# EAGLE design door system (EAGLE 9.7.0)
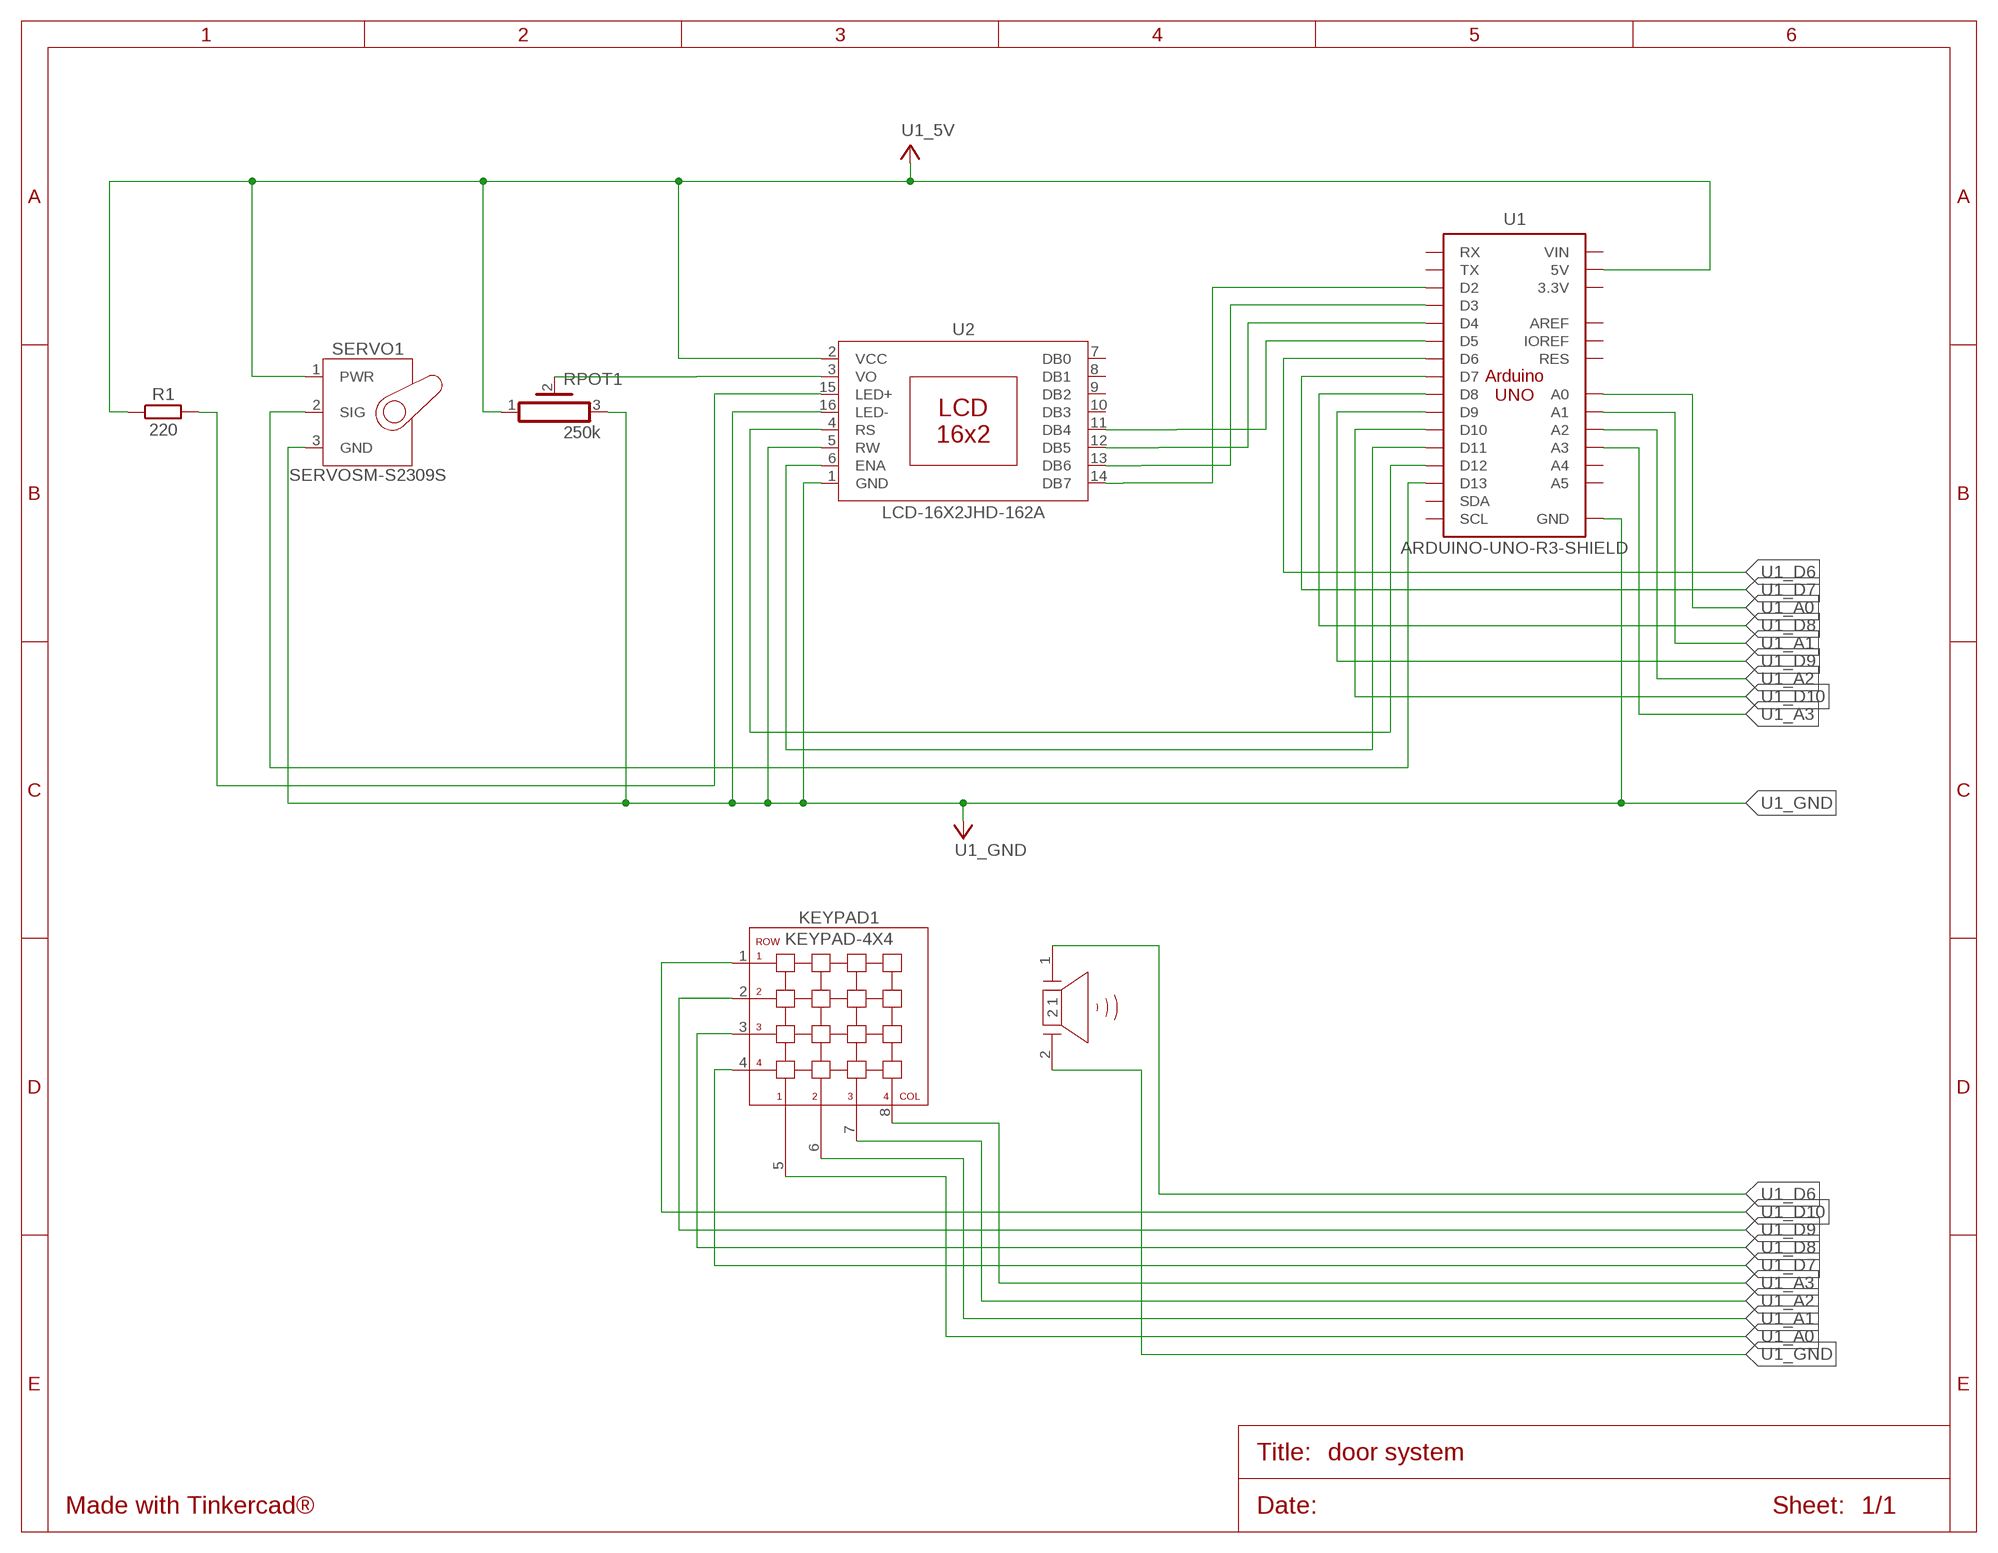
[diagram p0: schematic, sheet 1]

## Parts
KEYPAD1  KEYPAD-4X4  [1X08]
PIEZO1  PIEZO  [PIEZO]
R1  220  RESISTOR_AXIAL-10.16MM-PITCH  [RESAD1016W63L850D250B]
RPOT1  250k  POT_HA-06  [HA-06-SM065]
SERVO1  SERVOSM-S2309S  [SM-S2309S]
U1  ARDUINO-UNO-R3-SHIELD  [ARDUINO-UNO-R3-SHIELD]
U2  LCD-16X2JHD-162A  [JHD-162A]

## Nets
U1_5V: R1.1 RPOT1.1 SERVO1.1(PWR) U1.5V U2.2(VCC)
U1_A0: KEYPAD1.5(COL1) U1.A0
U1_A1: KEYPAD1.6(COL2) U1.A1
U1_A2: KEYPAD1.7(COL3) U1.A2
U1_A3: KEYPAD1.8(COL4) U1.A3
U1_D2: U1.D2 U2.14(DB7)
U1_D3: U1.D3 U2.13(DB6)
U1_D4: U1.D4 U2.12(DB5)
U1_D5: U1.D5 U2.11(DB4)
U1_D6: PIEZO1.1 U1.D6
U1_D7: KEYPAD1.4(ROW4) U1.D7
U1_D8: KEYPAD1.3(ROW3) U1.D8
U1_D9: KEYPAD1.2(ROW2) U1.D9
U1_D10: KEYPAD1.1(ROW1) U1.D10
U1_D11: U1.D11 U2.6(ENA)
U1_D12: U1.D12 U2.4(RS)
U1_D13: SERVO1.2(SIG) U1.D13
U1_GND: PIEZO1.2 RPOT1.3 SERVO1.3(GND) U1.GND@0(GND) U1.GND@1(GND) U1.GND@2(GND) U2.1(GND) U2.5(RW) U2.16(LED-)
U2_LED+: R1.2 U2.15(LED+)
U2_VO: RPOT1.2 U2.3(VO)
Unconnected: U1.3.3V U1.A4 U1.A5 U1.AREF U1.IOREF U1.RES U1.RX U1.SCL U1.SDA U1.TX U1.VIN U2.7(DB0) U2.8(DB1) U2.9(DB2) U2.10(DB3)

## Library data of the parts
KEYPAD1 = Tinkercad:KEYPAD-4X4
PIEZO1 = Tinkercad:PIEZO: Piezoelectric Sounders / Buzzers Reference Datasheet <https://www.murata.com/products/productdata/8801054621726/SPEC-PKM17EPPH4001-B0.pdf?1517839212000>
R1 = Tinkercad:RESISTOR: Resistor Fixed - Generic
RPOT1 = Tinkercad:POT: Rectangular Trimmer Potentiometers - PV36 Series Datasheet <https://www.bourns.com/docs/Product-Datasheets/pv36.pdf>
SERVO1 = Tinkercad:SERVO
U1 = Tinkercad:ARDUINO-UNO-R3-SHIELD
U2 = Tinkercad:LCD-16X2

## Board
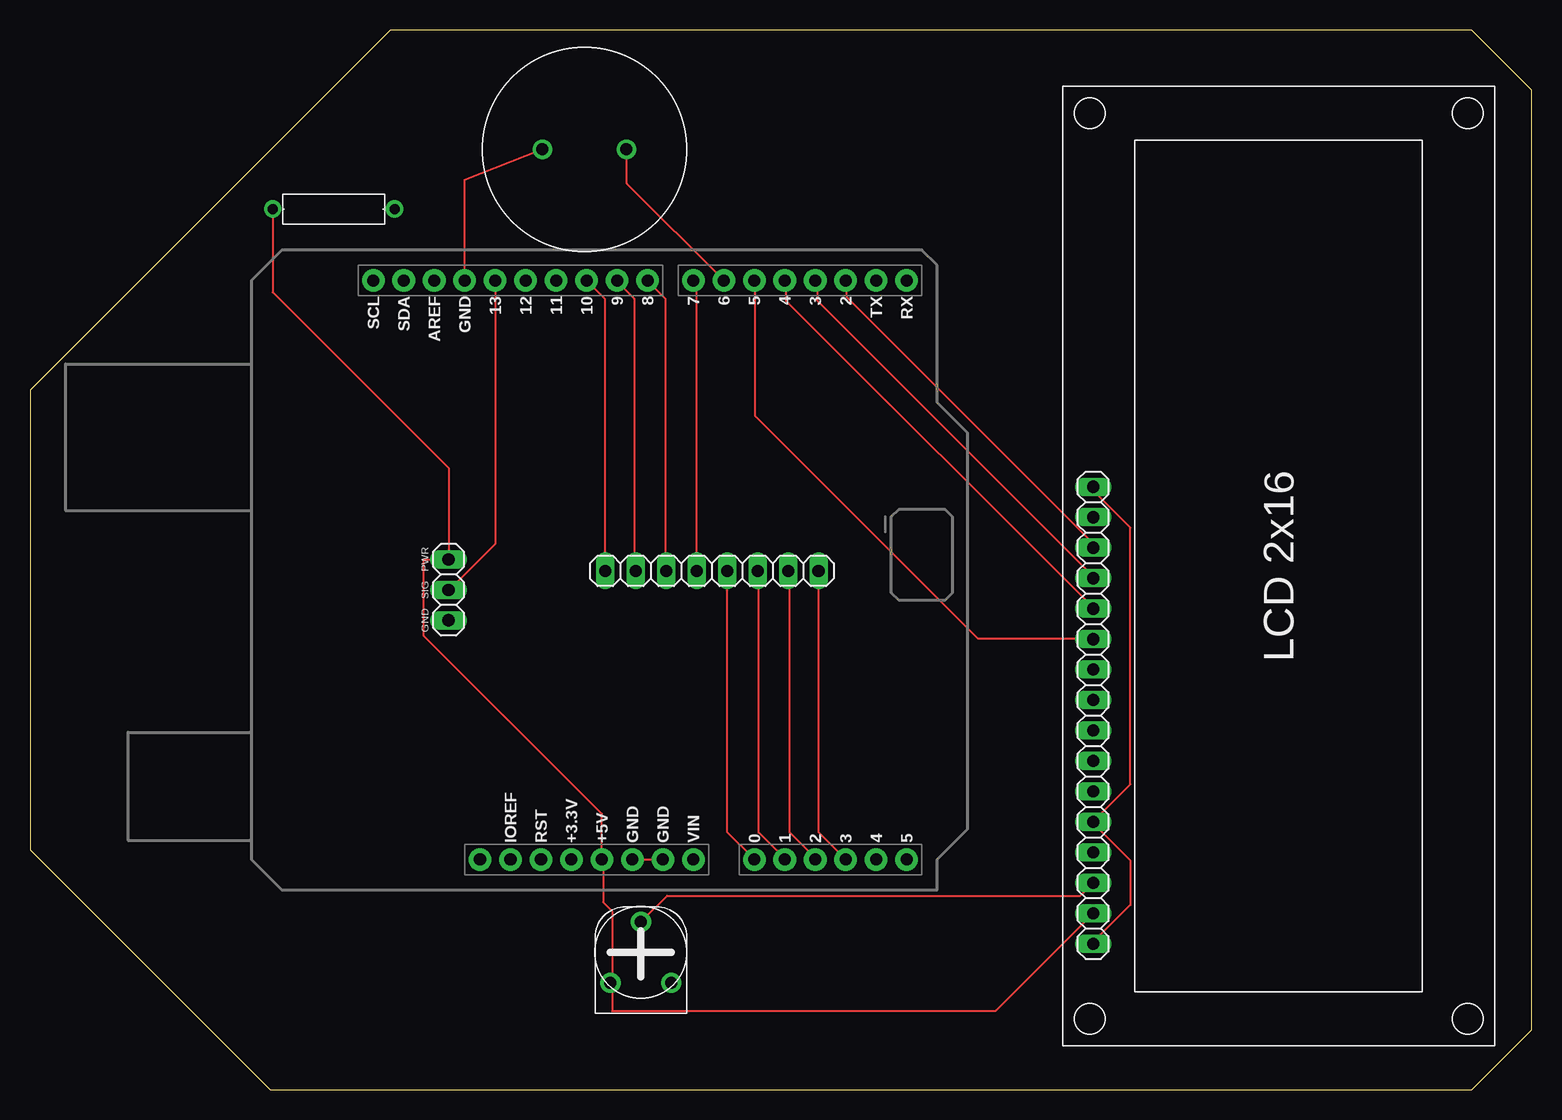
[diagram p1: board, top side]
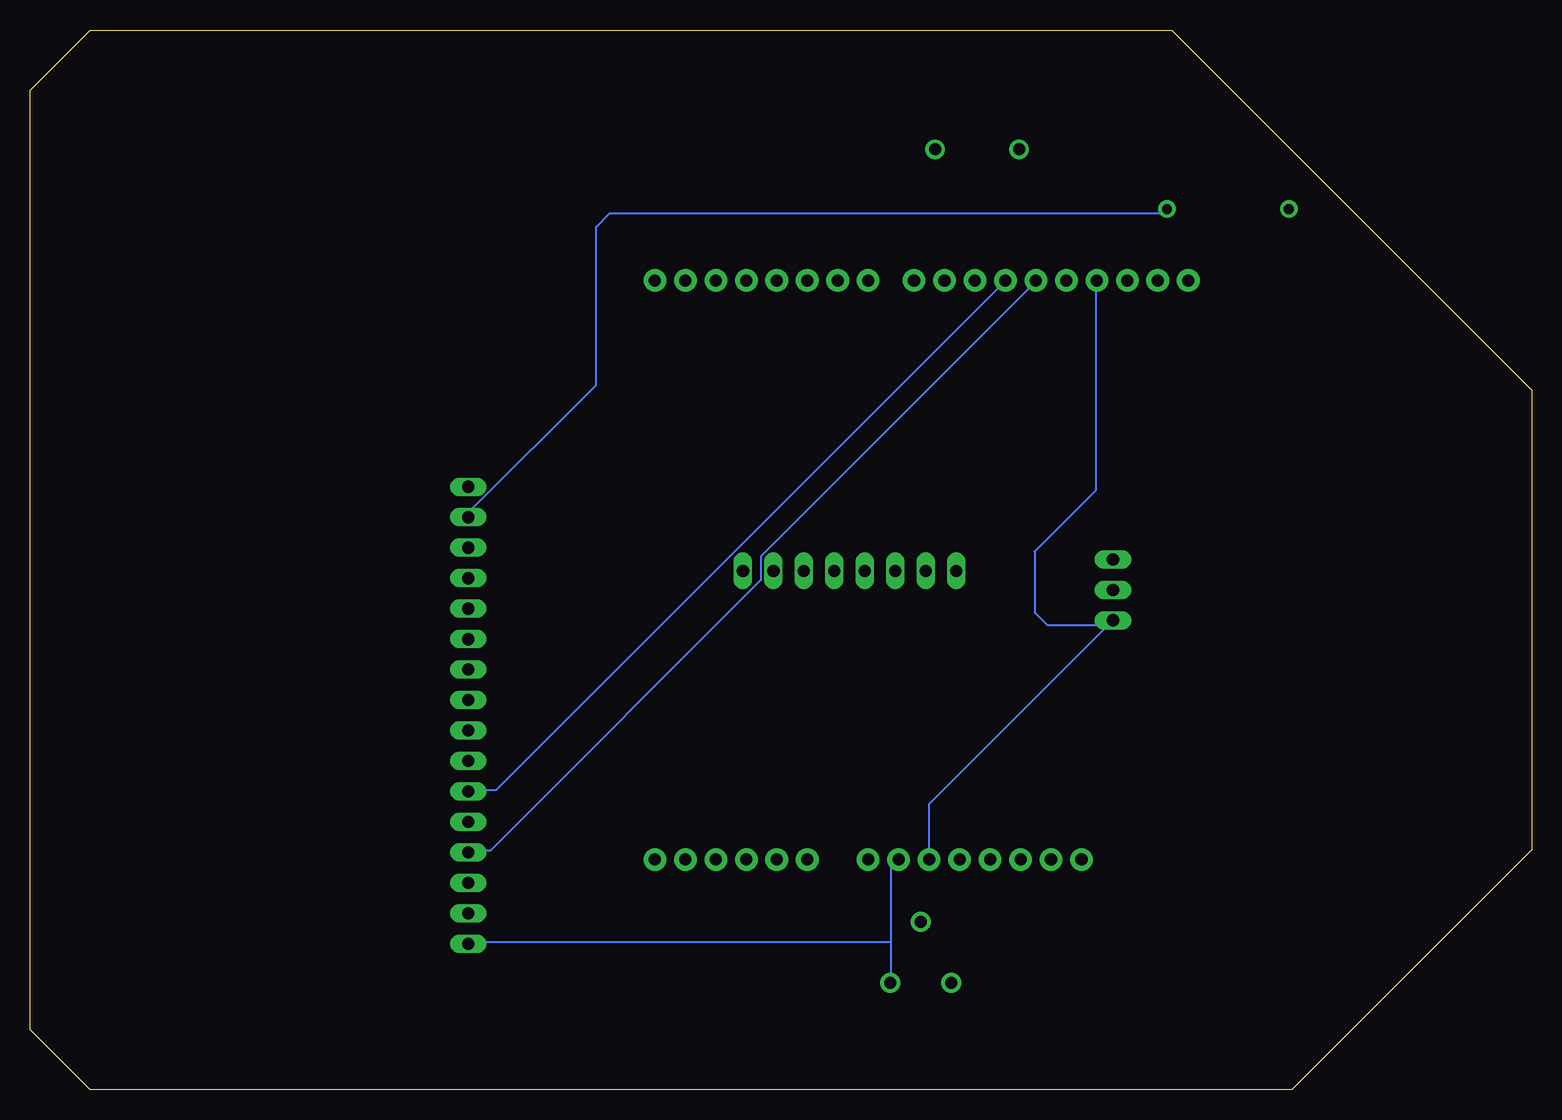
[diagram p2: board, bottom side, seen from below]

Size 125.13 x 88.35 mm. Coordinates in mm from the lower left corner, seen from the top.
Outline: 120.13,88.35 30,88.35 0,58.35 0,20 20,0 120.13,0 125.13,5 125.13,83.35 120.13,88.35
Copper layers (1*16): Top 0.035mm / dielectric 1.5mm / Bottom 0.035mm
Design rules "default": minimum track width 6mil, minimum drill 0.35mm, track to track 6mil, track to pad 6mil, pad to pad 6mil, via to via 6mil, smd to smd 6mil, copper to edge 40mil, drill to drill 6mil, minimum pad ring 10mil, minimum via ring 8mil, stop-mask expansion 4mil, vias tented up to drill 0mil, thermal gap 10mil

### Footprints (pad centres in the part's own frame; a part is rotated, then mirrored left to right if it is on the bottom)
1X08 = drill 1.016 long: 1 -8.89,0; 2 -6.35,0; 3 -3.81,0; 4 -1.27,0; 5 1.27,0; 6 3.81,0; 7 6.35,0; 8 8.89,0
PIEZO = drill 1 pad 1.6: 1 -3.5,0; 2 3.5,0
RESAD1016W63L850D250B = drill 0.83 pad 1.43: 1 -5.08,0; 2 5.08,0
HA-06-SM065 = drill 1 pad 1.676: 1 -2.54,-2.54; 2 0,2.54; 3 2.54,-2.54
SM-S2309S = drill 1.016 long: 1 -2.54,0; 2 0,0; 3 2.54,0
ARDUINO-UNO-R3-SHIELD = drill 1.016 pad 1.88: 3.3V 24.13,-2.54; 5V 24.13,0; A0 24.13,12.7; A1 24.13,15.24; A2 24.13,17.78; A3 24.13,20.32; A4 24.13,22.86; A5 24.13,25.4; AREF -24.13,-13.97; D2 -24.13,20.32; D3 -24.13,17.78; D4 -24.13,15.24; D5 -24.13,12.7; D6 -24.13,10.16; D7 -24.13,7.62; D8 -24.13,3.81; D9 -24.13,1.27; D10 -24.13,-1.27; D11 -24.13,-3.81; D12 -24.13,-6.35; D13 -24.13,-8.89; GND@0 24.13,2.54; GND@1 24.13,5.08; GND@2 -24.13,-11.43; IOREF 24.13,-7.62; NC 24.13,-10.16; RES 24.13,-5.08; RX -24.13,25.4; SCL -24.13,-19.05; SDA -24.13,-16.51; TX -24.13,22.86; VIN 24.13,7.62
JHD-162A = drill 1.016 long: 1 -19.05,0; 2 -16.51,0; 3 -13.97,0; 4 -11.43,0; 5 -8.89,0; 6 -6.35,0; 7 -3.81,0; 8 -1.27,0; 9 1.27,0; 10 3.81,0; 11 6.35,0; 12 8.89,0; 13 11.43,0; 14 13.97,0; 15 16.51,0; 16 19.05,0

### Placement (x,y rotation side)
KEYPAD1  56.83,43.26 0 top
PIEZO1  46.2,78.4 180 top
R1  25.3,73.43 0 top
RPOT1  50.91,11.45 0 top
SERVO1  34.88,41.68 270 top
U1  47.66,43.33 270 top
U2  88.6,31.22 90 top

### Tracks (layer width: path | path; a pad name or v marks a point on that pad's centre or on a via)
U1_5V
  Top 0.152: 48.52,9.06 RPOT1.1 | U2.2 80.47,6.58 48.52,6.58 48.52,9.06 | 48.52,9.06 48.52,14.88 47.76,15.64 47.76,19.17 U1.5V 47.66,23.01 32.82,37.85 32.82,44.22 SERVO1.1 34.88,51.84 20.22,66.5 R1.1
U1_A0
  Top 0.152: KEYPAD1.5 58.12,43.25 58.12,21.45 60.25,19.32 U1.A0
U1_A1
  Top 0.152: KEYPAD1.6 60.71,43.25 60.71,21.45 62.85,19.32 U1.A1
U1_A2
  Top 0.152: KEYPAD1.7 63.3,43.25 63.3,21.45 65.44,19.32 U1.A2
U1_A3
  Top 0.152: KEYPAD1.8 65.74,43.25 65.74,21.45 67.87,19.32 U1.A3
U1_D2
  Top 0.152: U2.14 88.6,45.53 68.03,66.11 68.03,67.33 U1.D2
U1_D3
  Top 0.152: U2.13 88.6,42.79 65.59,65.8 65.59,67.33 U1.D3
U1_D4
  Top 0.152: U2.12 88.6,40.2 63,65.8 63,67.33 U1.D4
U1_D5
  Top 0.152: U2.11 88.6,37.61 79,37.61 60.41,56.2 60.41,67.33 U1.D5
U1_D6
  Top 0.152: PIEZO1.1 49.74,78.35 49.74,75.56 57.82,67.48 U1.D6
U1_D7
  Top 0.152: KEYPAD1.4 55.53,43.4 55.53,67.17 55.38,67.33 U1.D7
U1_D8
  Top 0.152: KEYPAD1.3 52.94,43.4 52.94,65.96 51.57,67.33 U1.D8
U1_D9
  Top 0.152: KEYPAD1.2 50.35,43.4 50.35,65.96 48.98,67.33 U1.D9
U1_D10
  Top 0.152: KEYPAD1.1 47.91,43.4 47.91,65.96 46.54,67.33 U1.D10
U1_D11
  Bottom 0.152: U2.6 88.6,24.96 86.31,24.96 43.95,67.33 U1.D11
U1_D12
  Bottom 0.152: U2.4 88.6,19.93 86.77,19.93 64.22,42.49 64.22,44.47 41.36,67.33 U1.D12
U1_D13
  Top 0.152: U1.D13 38.77,45.51 34.93,41.68 SERVO1.2
U1_GND
  Top 0.152: U1.GND@2 36.23,75.85 PIEZO1.2 | U1.GND@0 50.35,19.17 52.63,19.17 U1.GND@1 | U2.1 88.6,12.31 91.7,15.41 91.7,19.12 88.6,22.22 U2.5 88.6,22.37 91.7,25.47 91.7,46.85 88.6,49.95 U2.16 | 34.88,39.51 SERVO1.3
  Bottom 0.152: 53.4,12.31 53.4,18.56 52.79,19.17 U1.GND@1 | 53.4,12.31 53.4,9.06 RPOT1.3 | 53.4,12.31 88.6,12.31 U2.1 | U1.GND@0 50.2,23.82 35.27,38.74 | 35.27,38.74 SERVO1.3 | U1.GND@2 36.33,67.36 36.33,49.95 41.41,44.87 41.41,39.79 40.35,38.74 35.27,38.74
U2_LED+
  Bottom 0.152: R1.2 30.73,73.08 76.8,73.08 77.96,71.92 77.96,58.75 88.6,48.1 U2.15
U2_VO
  Top 0.152: U2.3 87.52,16.17 53.09,16.17 RPOT1.2